# EAGLE schematic wendor arduino (EAGLE 8.7.1)
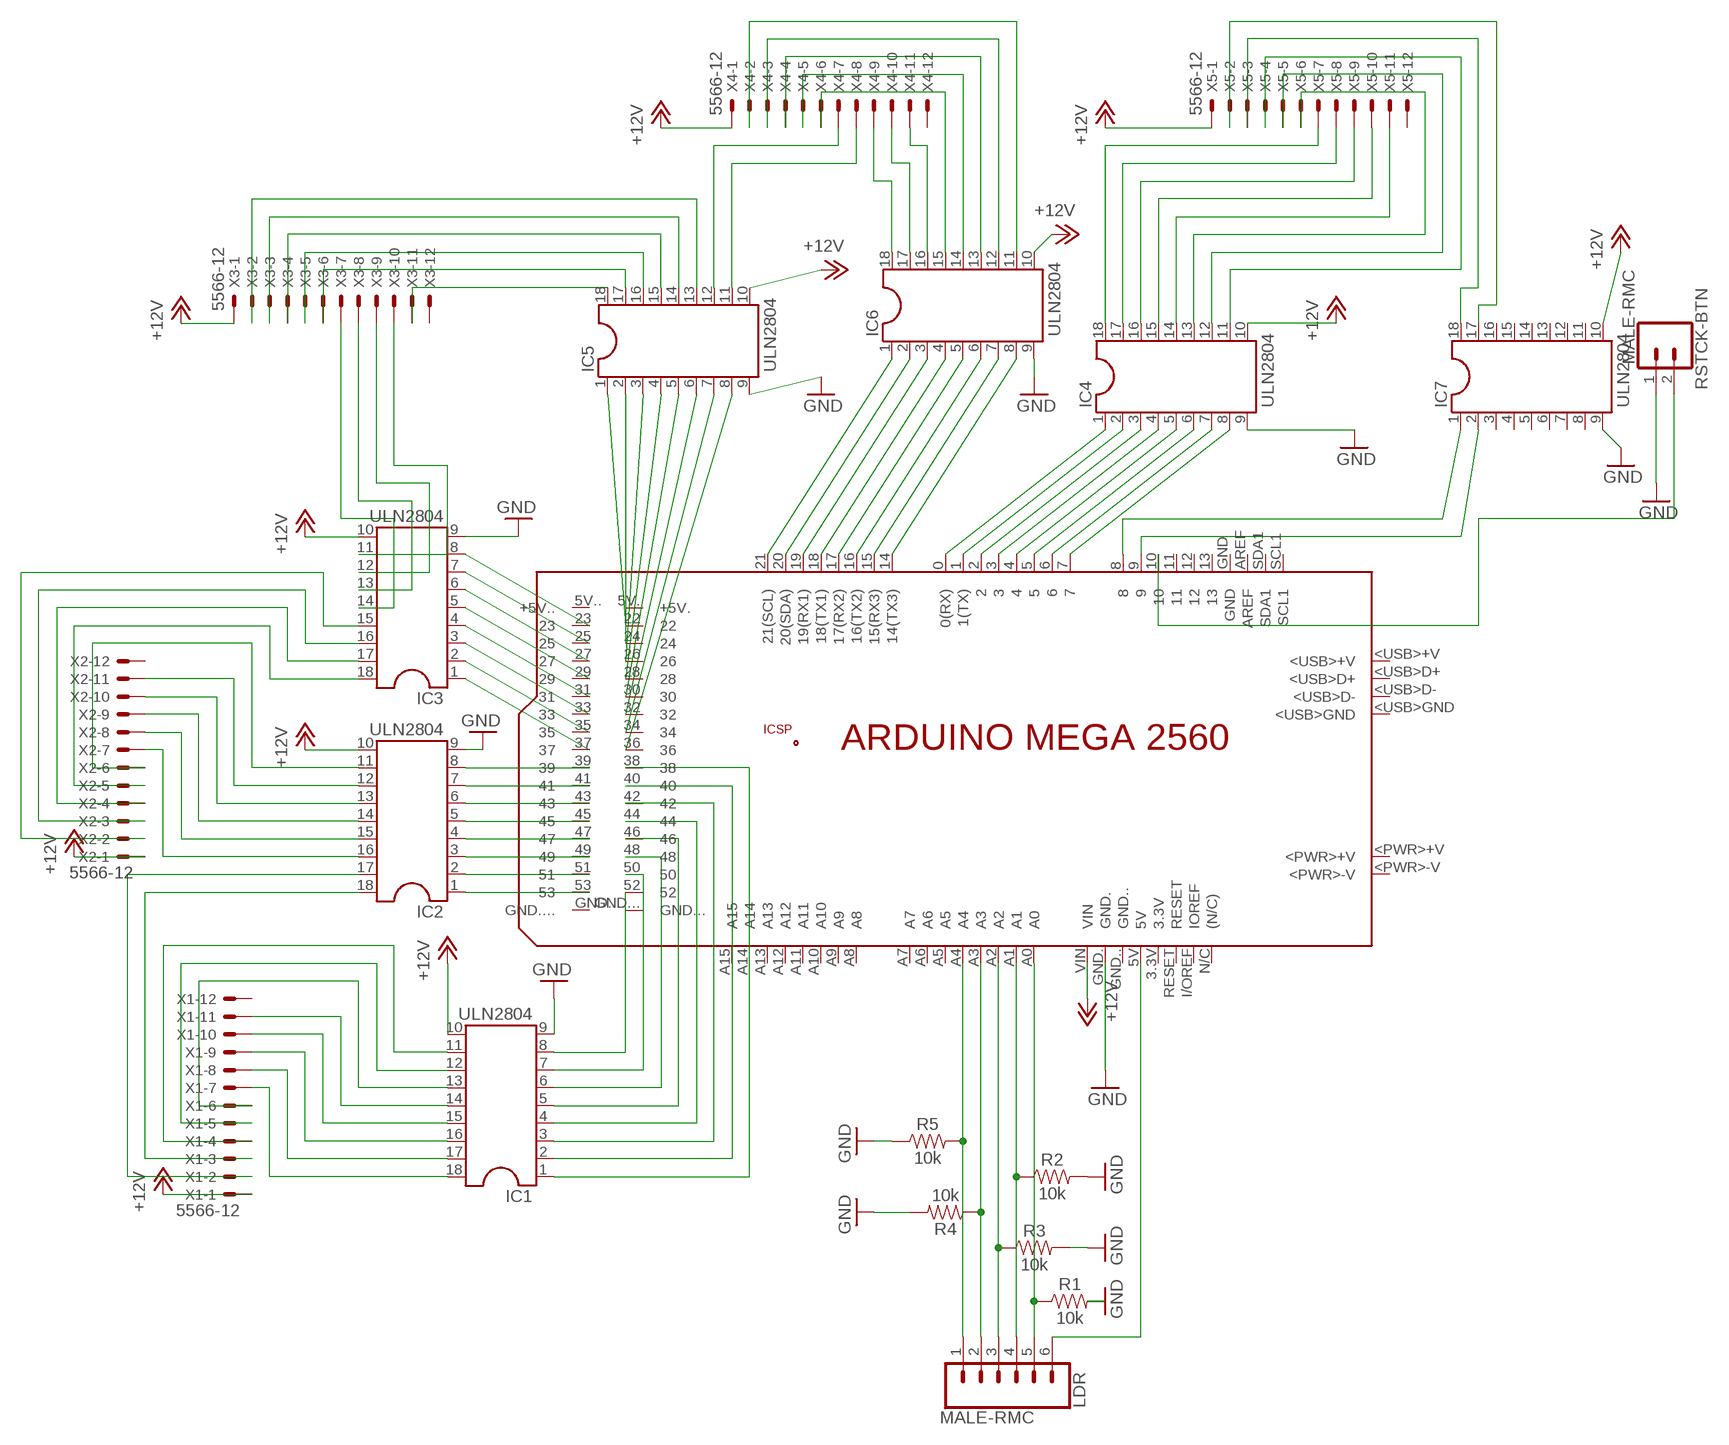
[diagram p0: schematic, sheet 1]

## Parts
IC1  ULN2804  DIL18S  [SOCKET-18]
IC2  ULN2804  DIL18S  [SOCKET-18]
IC3  ULN2804  DIL18S  [SOCKET-18]
IC4  ULN2804  DIL18S  [SOCKET-18]
IC5  ULN2804  DIL18S  [SOCKET-18]
IC6  ULN2804  DIL18S  [SOCKET-18]
IC7  ULN2804  DIL18S  [SOCKET-18]
LDR  MALE-RMC  CONN_06SILK_FEMALE_PTH  [1X06]
PCB1  ARDUINO_MEGA2560  [ARDUINO_MEGA2560]
R1  10k  10KOHM-HORIZ-1/4W-1%  [AXIAL-0.3]
R2  10k  10KOHM-HORIZ-1/4W-1%  [AXIAL-0.3]
R3  10k  10KOHM-HORIZ-1/4W-1%  [AXIAL-0.3]
R4  10k  10KOHM-HORIZ-1/4W-1%  [AXIAL-0.3]
R5  10k  10KOHM-HORIZ-1/4W-1%  [AXIAL-0.3]
RSTCK-BTN  MALE-RMC  CONN_02  [1X02]
X1  5566-12  [5566-12]
X2  5566-12  [5566-12]
X3  5566-12  [5566-12]
X4  5566-12  [5566-12]
X5  5566-12  [5566-12]

## Nets
+12V: IC1.10 IC2.10 IC3.10 IC4.10 IC5.10 IC6.10 IC7.10 PCB1.VIN X1.1 X2.1 X3.1 X4.1 X5.1
GND: IC1.9 IC2.9 IC3.9 IC4.9 IC5.9 IC6.9 IC7.9 PCB1.GND. R1.P$2 R2.P$2 R3.P$2 R4.P$2 R5.P$1 RSTCK-BTN.1
N$1: IC7.1 PCB1.8
N$2: IC7.2 PCB1.9
N$3: IC1.18 X1.7
N$4: IC1.17 X1.8
N$5: IC1.16 X1.9
N$6: IC1.15 X1.10
N$7: IC1.14 X1.11
N$8: IC1.13 X1.6
N$9: IC1.12 X1.5
N$10: IC5.1 PCB1.22
N$11: IC5.2 PCB1.24
N$12: IC5.3 PCB1.26
N$13: IC5.4 PCB1.28
N$14: IC1.11 X1.4
N$15: IC2.18 X1.3
N$16: IC2.17 X1.2
N$17: IC2.16 X2.7
N$18: IC2.15 X2.8
N$19: IC2.14 X2.9
N$20: IC2.13 X2.10
N$21: IC2.12 X2.11
N$22: IC2.11 X2.6
N$23: IC3.18 X2.5
N$24: IC3.17 X2.4
N$25: IC5.5 PCB1.30
N$26: IC3.16 X2.3
N$27: IC3.15 X2.2
N$28: IC3.14 X3.7
N$29: IC3.13 X3.8
N$30: IC3.12 X3.9
N$31: IC5.6 PCB1.32
N$32: IC3.11 X3.10
N$33: IC5.7 PCB1.34
N$34: IC5.8 PCB1.36
N$35: IC6.1 PCB1.21(21(SCL))
N$36: IC6.2 PCB1.20(20(SDA))
N$37: IC6.3 PCB1.19(19(RX1))
N$38: IC6.4 PCB1.18(18(TX1))
N$39: IC6.5 PCB1.17(17(RX2))
N$40: IC5.18 X3.11
N$41: IC6.6 PCB1.16(16(TX2))
N$42: IC6.7 PCB1.15(15(RX3))
N$43: IC6.8 PCB1.14(14(TX3))
N$44: IC4.1 PCB1.0(0(RX))
N$45: IC4.2 PCB1.1(1(TX))
N$46: IC4.3 PCB1.2
N$47: IC4.4 PCB1.3
N$48: IC5.17 X3.6
N$49: IC4.5 PCB1.4
N$50: IC4.6 PCB1.5
N$51: IC4.7 PCB1.6
N$52: IC4.8 PCB1.7
N$53: IC5.16 X3.5
N$54: IC5.15 X3.4
N$55: IC5.14 X3.3
N$56: IC5.13 X3.2
N$57: IC5.12 X4.7
N$58: IC5.11 X4.8
N$59: IC6.18 X4.9
N$60: IC6.17 X4.10
N$61: IC6.16 X4.11
N$63: IC6.15 X4.6
N$64: IC6.14 X4.5
N$65: IC6.13 X4.4
N$66: IC6.12 X4.3
N$67: IC6.11 X4.2
N$68: IC4.18 X5.7
N$69: IC4.17 X5.8
N$70: IC4.16 X5.9
N$71: IC4.15 X5.10
N$72: IC4.14 X5.11
N$73: PCB1.10 RSTCK-BTN.2
N$74: IC2.1 PCB1.53
N$75: IC2.2 PCB1.51
N$76: IC2.3 PCB1.49
N$77: IC2.4 PCB1.47
N$78: IC2.5 PCB1.45
N$79: IC2.6 PCB1.43
N$80: IC4.13 X5.6
N$81: IC2.7 PCB1.41
N$82: IC4.12 X5.5
N$83: IC4.11 X5.4
N$84: IC2.8 PCB1.39
N$85: LDR.1 PCB1.A4 R5.P$2
N$86: LDR.2 PCB1.A3 R4.P$1
N$87: LDR.3 PCB1.A2 R3.P$1
N$88: LDR.4 PCB1.A1 R2.P$1
N$89: LDR.5 PCB1.A0 R1.P$1
N$90: LDR.6 PCB1.5V
N$91: IC1.8 PCB1.52
N$92: IC1.7 PCB1.50
N$93: IC3.1 PCB1.37
N$94: IC3.2 PCB1.35
N$95: IC3.3 PCB1.33
N$96: IC3.4 PCB1.31
N$97: IC3.5 PCB1.29
N$98: IC3.6 PCB1.27
N$99: IC3.7 PCB1.25
N$100: IC3.8 PCB1.23
N$101: IC1.6 PCB1.48
N$102: IC1.5 PCB1.46
N$103: IC1.4 PCB1.44
N$104: IC1.3 PCB1.42
N$105: IC1.2 PCB1.40
N$106: IC1.1 PCB1.38
N$107: IC7.18 X5.3
N$108: IC7.17 X5.2
Unconnected: IC7.3 IC7.4 IC7.5 IC7.6 IC7.7 IC7.8 IC7.11 IC7.12 IC7.13 IC7.14 IC7.15 IC7.16 PCB1.3.3V PCB1.5V.(+5V.) PCB1.5V..(+5V..) PCB1.11 PCB1.12 PCB1.13 PCB1.+5V_ PCB1.<PWR>+V PCB1.<PWR>-V PCB1.<USB>+V PCB1.<USB>D+ PCB1.<USB>D- PCB1.<USB>GND PCB1.A5 PCB1.A6 PCB1.A7 PCB1.A8 PCB1.A9 PCB1.A10 PCB1.A11 PCB1.A12 PCB1.A13 PCB1.A14 PCB1.A15 PCB1.AREF PCB1.GND PCB1.GND.. PCB1.GND... PCB1.GND.... PCB1.GND__ PCB1.I/OREF(IOREF) PCB1.MISO PCB1.MOSI PCB1.N/C((N/C)) PCB1.RESET PCB1.RESET. PCB1.SCK PCB1.SCL1 PCB1.SDA1 X1.12 X2.12 X3.12 X4.12 X5.12

## Library data of the parts
IC1-IC7 = ic-package:DIL18: Dual In Line / Socket
LDR = SparkFun-Connectors:CONN_06: Multi connection point. Often used as Generic Header-pin footprint for 0.1 inch spaced/style header connections On any of the 0.1 inch spaced packages, you can populate with these: Break Away Headers - Straight <https://www.sparkfun.com/products/116> (PRT-00116) Break Away Male Headers - Right Angle <https://www.sparkfun.com/products/553> (PRT-00553) Female Headers <https://www.sparkfun.com/products/115> (PRT-00115) Break Away Headers - Machine Pin <https://www.sparkfun.com/products/117> (PRT-00117) Break Away Female Headers - Swiss Machine Pin <https://www.sparkfun.com/products/743> (PRT-00743) Arduino Stackable Header - 6 Pin <https://www.sparkfun.com/products/9280> (PRT-09280) For SCREWTERMINALS and SPRING TERMINALS visit here: Screw Terimnals on SparkFun.com <https://www.sparkfun.com/search/results?term=Screw+Terminals> (5mm/3.5mm/2.54mm spacing) This device is also useful as a general connection point to wire up your design to another part of your project. Our various solder wires solder well into these plated through hole pads. Hook-Up Wire - Assortment (Stranded, 22 AWG) <https://www.sparkfun.com/products/11375> (PRT-11375) Hook-Up Wire - Assortment (Solid Core, 22 AWG) <https://www.sparkfun.com/products/11367> (PRT-11367) View the entire wire category on our website here <https://www.sparkfun.com/categories/141>; PROD_ID: CONN-08437
PCB1 = E14_Arduino_revC:ARDUINO_MEGA2560: Device for representing an Arduino Mega 2560 board with a footprint in an EAGLE design. Created by Dave Young for Element14. More EAGLE documentation at: http://www.element14.com/community/community/knode/cadsoft_eagle
R1-R5 = SparkFun-Resistors:10KOHM: 10kΩ resistor A resistor is a passive two-terminal electrical component that implements electrical resistance as a circuit element. Resistors act to reduce current flow, and, at the same time, act to lower voltage levels within circuits. - Wikipedia; PROD_ID: RES-12183
RSTCK-BTN = SparkFun-Connectors:CONN_02: Multi connection point. Often used as Generic Header-pin footprint for 0.1 inch spaced/style header connections On any of the 0.1 inch spaced packages, you can populate with these: Break Away Headers - Straight <https://www.sparkfun.com/products/116> (PRT-00116) Break Away Male Headers - Right Angle <https://www.sparkfun.com/products/553> (PRT-00553) Female Headers <https://www.sparkfun.com/products/115> (PRT-00115) Break Away Headers - Machine Pin <https://www.sparkfun.com/products/117> (PRT-00117) Break Away Female Headers - Swiss Machine Pin <https://www.sparkfun.com/products/743> (PRT-00743) For SCREWTERMINALS and SPRING TERMINALS visit here: Screw Terimnals on SparkFun.com <https://www.sparkfun.com/search/results?term=Screw+Terminals> (5mm/3.5mm/2.54mm spacing) This device is also useful as a general connection point to wire up your design to another part of your project. Our various solder wires solder well into these plated through hole pads. Hook-Up Wire - Assortment (Stranded, 22 AWG) <https://www.sparkfun.com/products/11375> (PRT-11375) Hook-Up Wire - Assortment (Solid Core, 22 AWG) <https://www.sparkfun.com/products/11367> (PRT-11367) View the entire wire category on our website here <https://www.sparkfun.com/categories/141> Special notes: Molex polarized connector foot print use with: PRT-08233 with associated crimp pins and housings. 2.54_SCREWTERM for use with PRT-10571. 3.5mm Screw Terminal footprints for PRT-08084 5mm Screw Terminal footprints for use with PRT-08432
X1-X5 = con-molex:5566-12: Mini FIT connector 12 pol Source: http://www.molex.com; MF: MOLEX; OC_FARNELL: unknown; OC_NEWARK: unknown